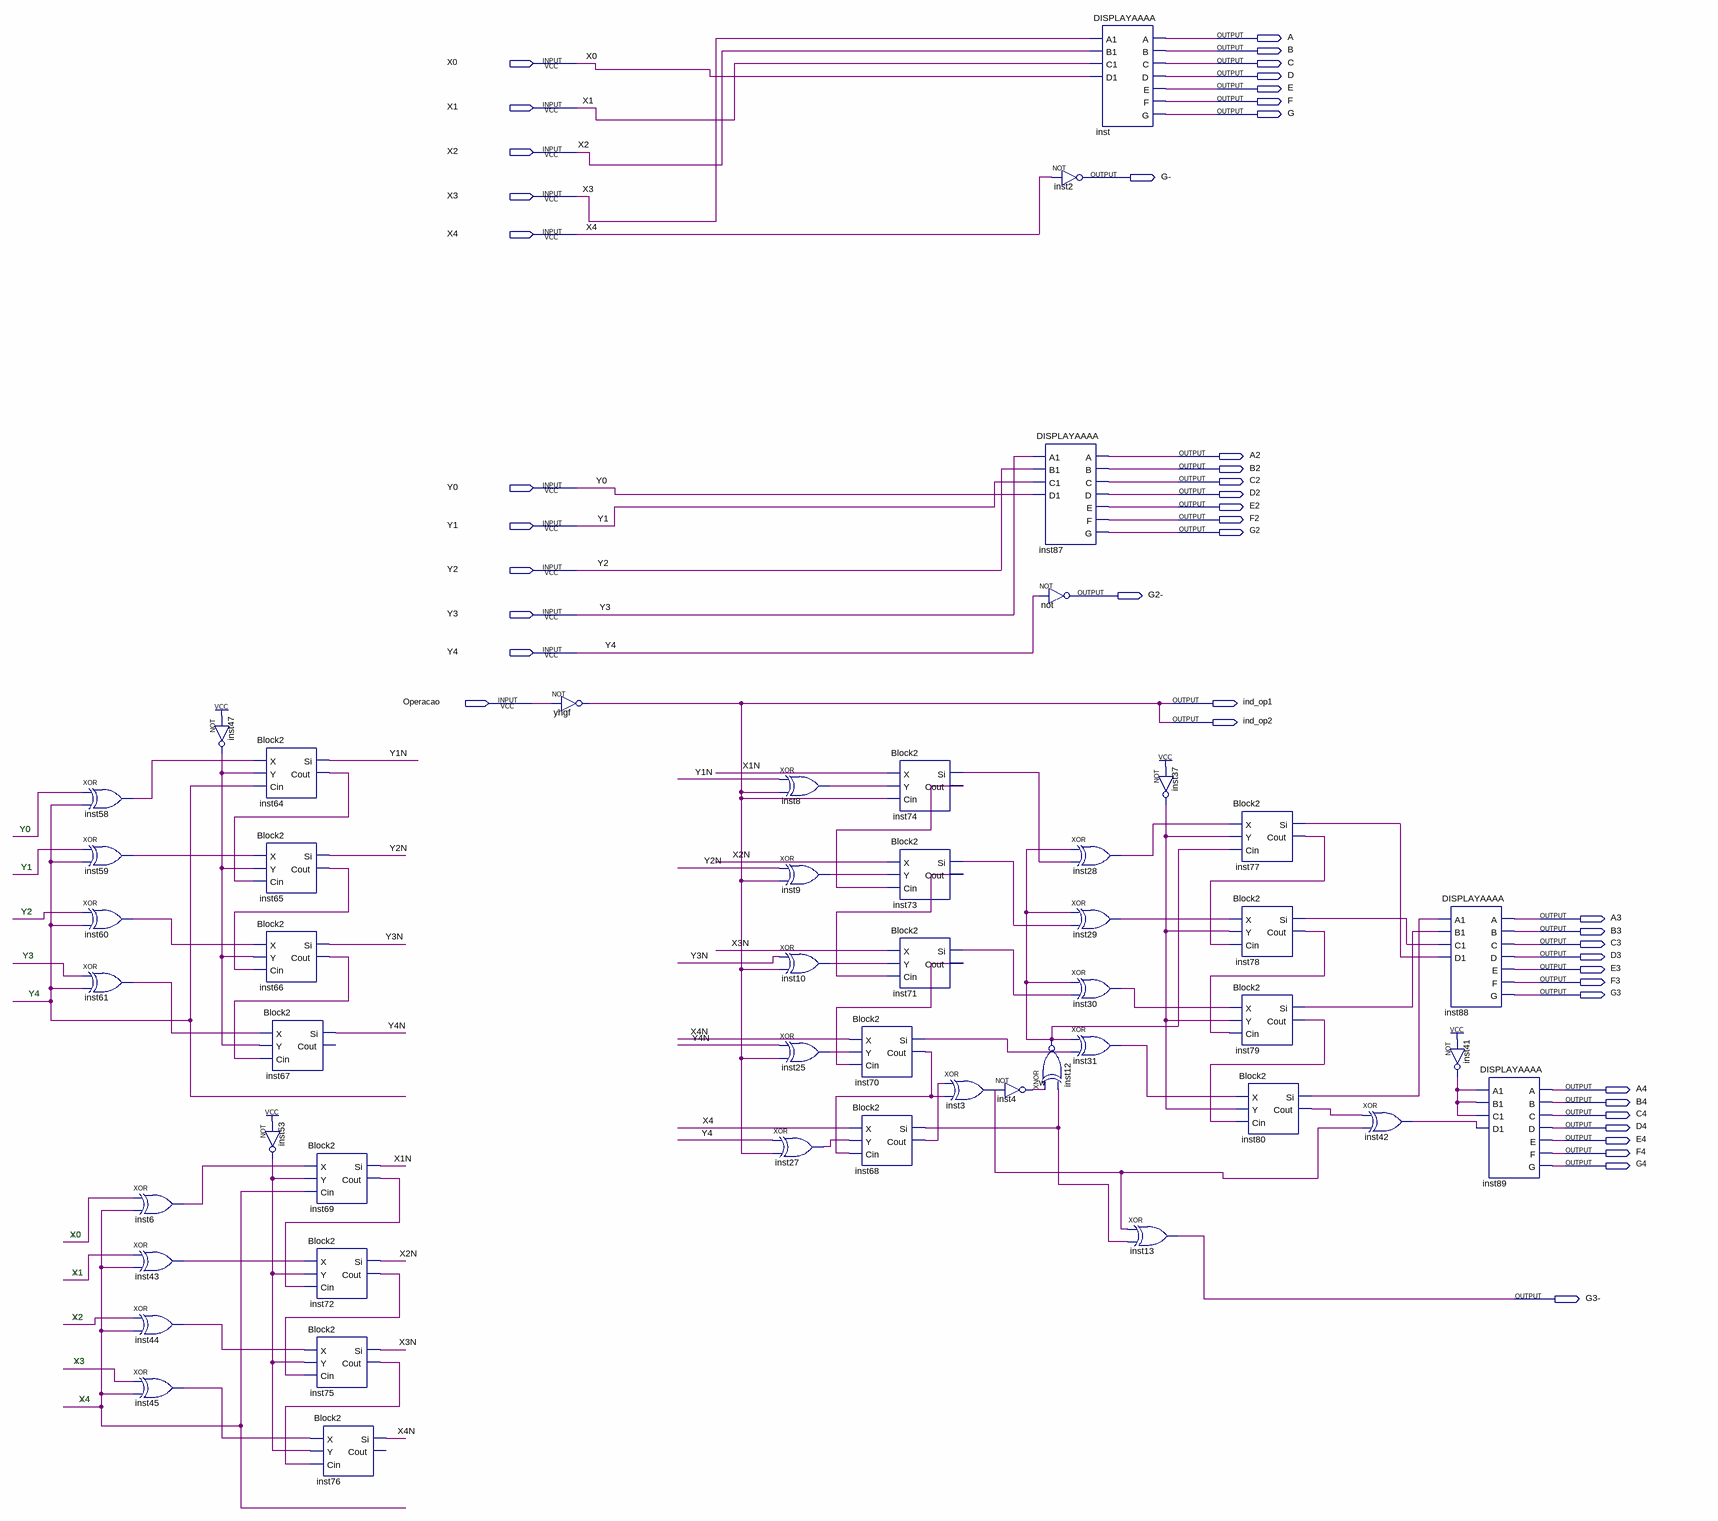
[diagram p0: schematic sheet]
// Quartus schematic aula09.bdf as structural Verilog: 50 symbols, 44 pins
module aula09 (
  input  X0,
  input  X1,
  input  X2,
  input  X3,
  input  X4,
  input  Y0,
  input  Y1,
  input  Y2,
  input  Y3,
  input  Y4,
  input  Operacao,
  output A,
  output B,
  output C,
  output D,
  output E,
  output F,
  output G,
  output \G- ,
  output A2,
  output B2,
  output C2,
  output D2,
  output E2,
  output F2,
  output G2,
  output \G2- ,
  output ind_op1,
  output ind_op2,
  output A3,
  output B3,
  output C3,
  output D3,
  output E3,
  output F3,
  output G3,
  output A4,
  output B4,
  output C4,
  output D4,
  output E4,
  output F4,
  output G4,
  output \G3- 
);

  wire inst3_out, inst6_out, inst8_out, inst9_out, inst10_out, inst12_out, inst25_out, inst27_out,
       inst28_out, inst29_out, inst30_out, inst31_out, inst37_out, inst41_out, inst42_out, inst43_out,
       inst44_out, inst45_out, inst47_out, inst53_out, inst58_out, inst59_out, inst60_out, inst61_out,
       inst64_cout, inst65_cout, inst66_cout, inst68_cout, inst68_si, inst69_cout, inst70_cout, inst70_si,
       inst71_cout, inst71_si, inst72_cout, inst73_cout, inst73_si, inst74_cout, inst74_si, inst75_cout,
       inst77_cout, inst77_si, inst78_cout, inst78_si, inst79_cout, inst79_si, inst80_cout, inst80_si, w,
       X1N, X2N, X3N, X4N, Y1N, Y2N, Y3N, Y4N;

  xor inst58 (inst58_out, Y0, Y4);
  xor inst59 (inst59_out, Y1, Y4);
  xor inst60 (inst60_out, Y2, Y4);
  xor inst61 (inst61_out, Y3, Y4);
  xor inst6 (inst6_out, X0, X4);
  xor inst43 (inst43_out, X1, X4);
  xor inst44 (inst44_out, X2, X4);
  xor inst45 (inst45_out, X3, X4);
  not inst47 (inst47_out, 1'b1);
  Block2 inst64 (.X(inst58_out), .Y(inst47_out), .Cin(Y4), .Si(Y1N), .Cout(inst64_cout));
  Block2 inst65 (.X(inst59_out), .Y(inst47_out), .Cin(inst64_cout), .Si(Y2N), .Cout(inst65_cout));
  Block2 inst66 (.X(inst60_out), .Y(inst47_out), .Cin(inst65_cout), .Si(Y3N), .Cout(inst66_cout));
  Block2 inst67 (.X(inst61_out), .Y(inst47_out), .Cin(inst66_cout), .Si(Y4N));  // open: Cout
  not inst53 (inst53_out, 1'b1);
  Block2 inst69 (.X(inst6_out), .Y(inst53_out), .Cin(X4), .Si(X1N), .Cout(inst69_cout));
  Block2 inst72 (.X(inst43_out), .Y(inst53_out), .Cin(inst69_cout), .Si(X2N), .Cout(inst72_cout));
  Block2 inst75 (.X(inst44_out), .Y(inst53_out), .Cin(inst72_cout), .Si(X3N), .Cout(inst75_cout));
  Block2 inst76 (.X(inst45_out), .Y(inst53_out), .Cin(inst75_cout), .Si(X4N));  // open: Cout
  not yhgf (ind_op1, Operacao);
  xor inst27 (inst27_out, Y4, ind_op1);
  xor inst8 (inst8_out, Y1N, ind_op1);
  xor inst9 (inst9_out, Y2N, ind_op1);
  xor inst10 (inst10_out, Y3N, ind_op1);
  xor inst25 (inst25_out, Y4N, ind_op1);
  Block2 inst70 (.X(X4N), .Y(inst25_out), .Cin(inst71_cout), .Si(inst70_si), .Cout(inst70_cout));
  Block2 inst68 (.X(X4), .Y(inst27_out), .Cin(inst70_cout), .Si(inst68_si), .Cout(inst68_cout));
  Block2 inst74 (.X(X1N), .Y(inst8_out), .Cin(ind_op1), .Si(inst74_si), .Cout(inst74_cout));
  Block2 inst73 (.X(X2N), .Y(inst9_out), .Cin(inst74_cout), .Si(inst73_si), .Cout(inst73_cout));
  Block2 inst71 (.X(X3N), .Y(inst10_out), .Cin(inst73_cout), .Si(inst71_si), .Cout(inst71_cout));
  xor inst3 (inst3_out, inst68_cout, inst70_cout);
  not inst4 (w, inst3_out);
  not inst2 (\G- , X4);
  DISPLAYAAAA inst87 (.A1(Y3), .B1(Y2), .C1(Y1), .D1(Y0), .A(A2), .B(B2), .C(C2), .D(D2), .E(E2), .F(F2), .G(G2));
  not \not  (\G2- , Y4);
  xor inst28 (inst28_out, inst12_out, inst74_si);
  xor inst29 (inst29_out, inst12_out, inst73_si);
  xor inst30 (inst30_out, inst12_out, inst71_si);
  xor inst31 (inst31_out, inst12_out, inst70_si);
  xnor inst12 (inst12_out, w, inst68_si);
  DISPLAYAAAA inst (.A1(X3), .B1(X2), .C1(X1), .D1(X0), .A(A), .B(B), .C(C), .D(D), .E(E), .F(F), .G(G));
  xor inst13 (\G3- , inst3_out, inst68_si);
  not inst37 (inst37_out, 1'b1);
  Block2 inst77 (.X(inst28_out), .Y(inst37_out), .Cin(inst12_out), .Si(inst77_si), .Cout(inst77_cout));
  Block2 inst78 (.X(inst29_out), .Y(inst37_out), .Cin(inst77_cout), .Si(inst78_si), .Cout(inst78_cout));
  Block2 inst79 (.X(inst30_out), .Y(inst37_out), .Cin(inst78_cout), .Si(inst79_si), .Cout(inst79_cout));
  Block2 inst80 (.X(inst31_out), .Y(inst37_out), .Cin(inst79_cout), .Si(inst80_si), .Cout(inst80_cout));
  xor inst42 (inst42_out, inst80_cout, inst3_out);
  DISPLAYAAAA inst88 (
    .A1(inst80_si), .B1(inst79_si), .C1(inst78_si), .D1(inst77_si), .A(A3), .B(B3), .C(C3), .D(D3), .E(E3),
    .F(F3), .G(G3));
  not inst41 (inst41_out, 1'b1);
  DISPLAYAAAA inst89 (
    .A1(inst41_out), .B1(inst41_out), .C1(inst41_out), .D1(inst42_out), .A(A4), .B(B4), .C(C4), .D(D4),
    .E(E4), .F(F4), .G(G4));

  assign ind_op2 = ind_op1;

  // Notes on the sheet:
  //   Y0
  //   Y1
  //   Y2
  //   Y3
  //   Y4
  //   Y0
  //   Y1
  //   Y2
  //   Y3
  //   Y4
endmodule
